# EAGLE schematic usb-can_v2_1 (EAGLE 9.2.2)
CNAME: Instituto Politécnico de Leiria; CREVISON: 2.0; DESIGNER: Rafael Silva
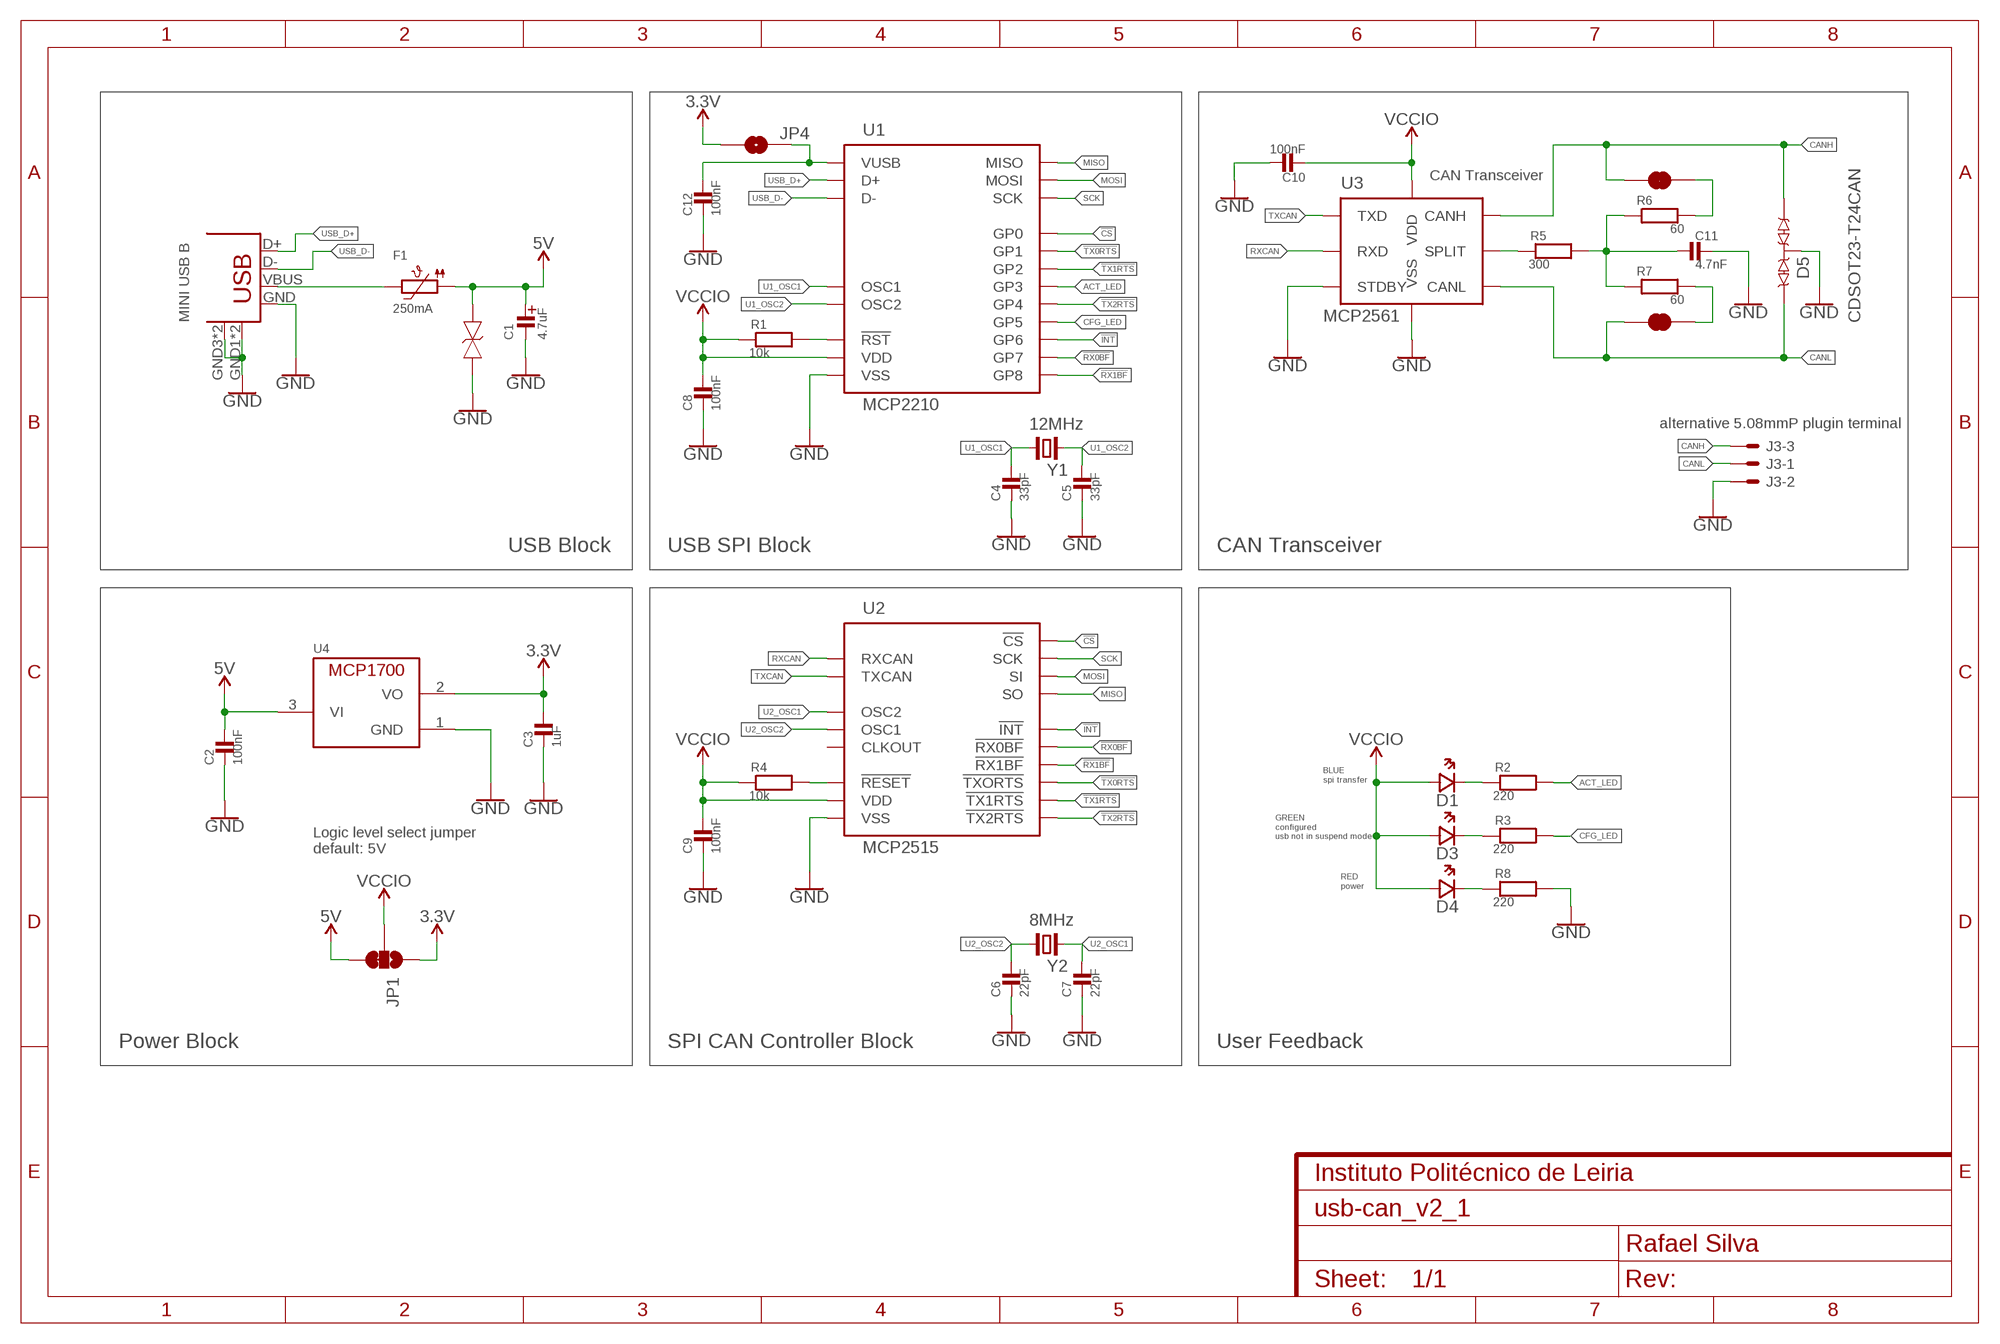
[diagram p0: schematic, sheet 1]

## Parts
C1  4.7uF  CAPACITOR_TAN3216  [EIA3216]
C2  100nF  CAPACITOR_C0603  [0603_WAVE]
C3  1uF  CAPACITOR_C0603  [0603_WAVE]
C4  33pF  CAPACITOR_C0603  [0603_WAVE]
C5  33pF  CAPACITOR_C0603  [0603_WAVE]
C6  22pF  CAPACITOR_C0603  [0603_WAVE]
C7  22pF  CAPACITOR_C0603  [0603_WAVE]
C8  100nF  CAPACITOR_C0603  [0603_WAVE]
C9  100nF  CAPACITOR_C0603  [0603_WAVE]
C10  100nF  CAPACITOR_C0603  [0603_WAVE]
C11  4.7nF  CAPACITOR_C0603  [0603_WAVE]
C12  100nF  CAPACITOR_C0603  [0603_WAVE]
D1  Blue  LED0603  [CHIPLED_0603]
D2  PESD5V0S1BAF  [SOD323]
D3  Green  LED0603  [CHIPLED_0603]
D4  Red  LED0603  [CHIPLED_0603]
D5  CDSOT23-T24CAN  [SOT-23-3]
F1  250mA  PTC1206  [_1206]
J2  USB_MINI_BMINIB  [USB-MINIB]
J3  1X32EHGR  [2EHGR]
JP1  JUMPER-SMT_3_1-NC_TRACE_SILK  [SMT-JUMPER_3_1-NC_TRACE_SILK]
JP2  JUMPER-SMT_2_NC_TRACE_SILK  [SMT-JUMPER_2_NC_TRACE_SILK]
JP3  JUMPER-SMT_2_NC_TRACE_SILK  [SMT-JUMPER_2_NC_TRACE_SILK]
JP4  JUMPER-SMT_2_NO_SILK  [SMT-JUMPER_2_NO_SILK]
R1  10k  RESISTOR0603  [0603_WAVE]
R2  220  RESISTOR0603  [0603_WAVE]
R3  220  RESISTOR0603  [0603_WAVE]
R4  10k  RESISTOR0603  [0603_WAVE]
R5  300  RESISTOR0603  [0603_WAVE]
R6  60  RESISTOR0603  [0603_WAVE]
R7  60  RESISTOR0603  [0603_WAVE]
R8  220  RESISTOR0603  [0603_WAVE]
U1  MCP2210  [SOIC-20_300MIL]
U2  MCP2515  [SOIC-18_300MIL]
U3  MCP2561  [SOIC_8]
U4  250mA  MCP1700T-3302TT  [SOT-23]
Y1  12MHz  CRYSTALNX5032GA  [2-SMD-5X3]
Y2  8MHz  CRYSTALNX5032GA  [2-SMD-5X3]

## Nets
3.3V: C3.P$1 JP1.1 JP4.2 U4.2(VO)
5V: C1.+(AN) C2.P$1 D2.P$1 F1.1 JP1.3 U4.3(VI)
!CS: U1.P$5(GP0) U2.P$16(!CS!)
!INT: U1.P$14(GP6) U2.P$12(!INT!)
!RX0BF: U1.P$15(GP7) U2.P$11(!RX0BF!)
!RX1BF: U1.P$16(GP8) U2.P$10(!RX1BF!)
!TX0RTS: U1.P$6(GP1) U2.P$4(!TXORTS!)
!TX1RTS: U1.P$7(GP2) U2.P$5(!TX1RTS!)
!TX2RTS: U1.P$10(GP4) U2.P$6(!TX2RTS!)
ACT_LED: R2.P$2 U1.P$8(GP3)
CANH: D5.P$2 J3.P$3 JP3.2 U3.P$7(CANH)
CANL: D5.P$1 J3.P$1 JP2.2 U3.P$6(CANL)
CFG_LED: R3.P$2 U1.P$12(GP5)
GND: C1.-(CA) C2.P$2 C3.P$2 C4.P$2 C5.P$2 C6.P$2 C7.P$2 C8.P$2 C9.P$2 C10.P$1 C11.P$1 C12.P$2 D2.P$2 D5.P$3 J2.GND J2.GND1 J2.GND2 J2.GND3 J2.GND4 J3.P$2 R8.P$2 U1.P$20(VSS) U2.P$9(VSS) U3.P$2(VSS) U3.P$8(STDBY) U4.1(GND)
MISO: U1.P$13(MISO) U2.P$15(SO)
MOSI: U1.P$9(MOSI) U2.P$14(SI)
N$1: JP2.1 R7.P$2
N$2: D1.C(CA) R2.P$1
N$3: D3.C(CA) R3.P$1
N$4: R1.P$2 U1.P$4(!RST!)
N$5: R4.P$2 U2.P$17(!RESET!)
N$6: D4.C(CA) R8.P$1
N$7: JP3.1 R6.P$2
N$8: F1.2 J2.VBUS
N$9: C12.P$1 JP4.1 U1.P$17(VUSB)
N$10: C11.P$2 R5.P$2 R6.P$1 R7.P$1
N$12: R5.P$1 U3.P$5(SPLIT)
RXCAN: U2.P$2(RXCAN) U3.P$4(RXD)
SCK: U1.P$11(SCK) U2.P$13(SCK)
TXCAN: U2.P$1(TXCAN) U3.P$1(TXD)
U1_OSC1: C4.P$1 U1.P$2(OSC1) Y1.1
U1_OSC2: C5.P$1 U1.P$3(OSC2) Y1.2
U2_OSC1: C7.P$1 U2.P$7(OSC2) Y2.2
U2_OSC2: C6.P$1 U2.P$8(OSC1) Y2.1
USB_D+: J2.D+ U1.P$19(D+)
USB_D-: J2.D- U1.P$18(D-)
VCCIO: C8.P$1 C9.P$1 C10.P$2 D1.A(AN) D3.A(AN) D4.A(AN) JP1.2 R1.P$1 R4.P$1 U1.P$1(VDD) U2.P$18(VDD) U3.P$3(VDD)
Unconnected: U2.P$3(CLKOUT)

## Notes on the sheet
- CAN Transceiver
- MINI USB B
- alternative 5.08mmP plugin terminal
- USB Block | USB SPI Block | CAN Transceiver
- BLUE
  spi transfer
- GREEN
  configured
  usb not in suspend mode
- Logic level select jumper
  default: 5V
- RED
  power
- Power Block | SPI CAN Controller Block | User Feedback

## Library data of the parts
C1 = capacitor:CAPACITOR_TAN: The KEMET T490, designed for customer product applications (low temperature demanding applications), meets RoHS compliance with leads constructed of 100% matte tin and green molding compound. The T490 is classified as MSL (Moisture Sensitivity Level) 1 under J STD 020: unlimited floor life time at ≤ 30°C/85% RH.
C2-C12 = capacitor:CAPACITOR_C: KEMET’s X7R dielectric features a 125°C maximum operating temperature and is considered temperature stable. The Electronics Components, Assemblies and Materials Association (EIA) characterizes X7R dielectric as a Class II material. Components of this classification are fixed, ceramic dielectric capacitors suited for bypass and decoupling applications or for frequency discriminating circuits where Q and stability of capacitance characteristics are not critical. X7R exhibits a predictable change in capacitance with respect to time and voltage, boasting a minimal change in capacitance with reference to ambient temperature. Capacitance change is limited to ±15% from −55°C to +125°C.
D1 D3 D4 = diode led:LED: LED 0603 - 0603 Surface Mount Package 2mA: Green LED - Low Power (3.9mcd, 2ma, 1.7Vf) - Digikey: 475-2709-2-ND Orange LED - Low Power (9.8mcd, 2ma, 1.8Vf) - Digikey: 475-1194-2-ND Red LED - Low Power (5mcd, 2ma, 1.8Vf) - Digikey: 475-1195-2-ND Yellow LED - Low Power (7mcd, 2ma, 1.8Vf) - Digikey: 475-1196-2-ND 5mA: Blue LED - Low Power (17mcd, 5ma, 2.9Vf) - Digikey: LNJ937W8CRACT-ND 0805 - 0805 Surface Mount Package 2mA: Red LED (8.8mcd, 2mA, 1.8Vf, Clear) - Low Power [Digikey: 475-2510-1-ND] Green LED (5mcd, 2mA, 1.8Vf, Clear) - Low Power [Digikey: 475-2730-1-ND] Yellow LED (11.3mcd, 2mA, 1.8Vf, Clear) - Low Power [Digikey: 475-2555-1-ND] 20mA: Red LED (104mcd, 20mA, Diffused) - LS R976 [Digikey: 475-1278-6-ND] Red LED (12mcd, 20mA, 2.0Vf, Clear) - APT2012EC [Digikey: 754-1128-1-ND] Green LED (15mcd, 20mA, 2.2Vf, Clear) - APT2012GC [Digikey: 754-1131-1-ND] Orange LED (160mcd, 20mA, 2.1Vf, Clear) - APT2012SECK [Digikey: 754-1130-1-ND] 1206 - 1206 Surface Mount Package Green LED (26mcd, 20mA, Diffused) - LG N971 [Digikey: 475-1407-6-ND] Red LED (15mcd, 20mA, Diffused) - LH N974 [Digikey: 475-1416-6-ND] Cree - Cree High-Power Surface Mount LEDs XPEBWT-L1-0000-00D50 - White 111lm 350mA 2.9Vf 6200K 110° XTEAWT-00-0000-00000LEE3 - White 114lm 350mA 2.85Vf 5000K 115° Everlight - Everlight 45-21 Series Surface Mount LEDs 45-21/QK2C-B2832AC2CB2/2T - Warm White 2000mcd 20mA 3.25Vf 3050K 120° 45-21/LK2C-B38452C4CB2/2T - Nuetral White 2000mcd 20mA 3.25Vf 4150K 120° 45-21/LK2C-B50634C6CB2/2T - Cold White 2200mcd 20mA 3.25Vf 5650K 120° PLCC2 Reverse Mount LS T77K-J1L2-1-0-2-R18-Z - Red 11.25mcd 2mA 1.8Vf 630nm 120° LO T77K-L1M2-24-Z - Orange 19.6mcd 2mA 1.8Vf 606nm 120° LY T77K-K2M1-26-Z - Yellow 15.7mcd 2mA 1.8Vf 587nm 120°
D2 = diode esd:PESD5V0S1BAF: Low capacitance bidirectional ElectroStatic Discharge (ESD) protection diode designed to protect one signal line from the damage caused by ESD and other transients.
D5 = diode esd:CDSOT23-T24CAN
F1 = fuse:PTC
J2 = conector:USB_MINI_B: USB+Shield USB connector with shield pins connectable
J3 = conector:1X3
JP1 = jumper:JUMPER-SMT_3_1-NC_TRACE: Normally closed trace jumper (1 of 2 connections) This jumper has a trace between two pads so it's normally closed (NC). The other connection is normally open (NO). Use a razor knife to open the connection. For best results follow the IPC guidelines for cutting traces: Cutout at least 0.063 mm (0.005 in). Remove all loose material to clean up the cut area. Seal the cut with an approved epoxy. Reapply solder to reclose the connection, or to close the NO connection.
JP2 JP3 = jumper:JUMPER-SMT_2_NC_TRACE: Normally closed trace jumper This jumper has a trace between two pads so it's normally closed (NC). Use a razor knife to open the connection. For best results follow the IPC guidelines for cutting traces: Cutout at least 0.063 mm (0.005 in). Remove all loose material to clean up the cut area. Seal the cut with an approved epoxy. Reapply solder to reclose the connection.
JP4 = jumper:JUMPER-SMT_2_NO: Normally open jumper This jumper has two pads in close proximity to each other. Apply solder to close the connection. Round pads are easier to solder for beginners, but are a lot larger. SparkFun Product that uses the round pads: SparkFun EL Sequencer <https://www.sparkfun.com/products/12781>
R1-R8 = resistor:RESISTOR: Resistors For new designs, use the packages preceded by an '_' character since they are more reliable: The following footprints should be used on most boards: _0402 - Standard footprint for regular board layouts _0603 - Standard footprint for regular board layouts _0805 - Standard footprint for regular board layouts _1206 - Standard footprint for regular board layouts For extremely tight-pitch boards where space is at a premium, the following 'micro-pitch' footprints can be used (smaller pads, no silkscreen outline, etc.): _0402MP - Micro-pitch footprint for very dense/compact boards _0603MP - Micro-pitch footprint for very dense/compact boards _0805MP - Micro-pitch footprint for very dense/compact boards _1206MP - Micro-pitch footprint for very dense/compact boards
U1 = converter usb spi:MCP2210
U2 = can controller:MCP2515
U3 = transiever can:MCP2561
U4 = regulator linear:MCP1700
Y1 Y2 = crystal:CRYSTAL: Citizen CM200S & CM250S Series